# EAGLE design EtherWeeny (EAGLE 6.2)
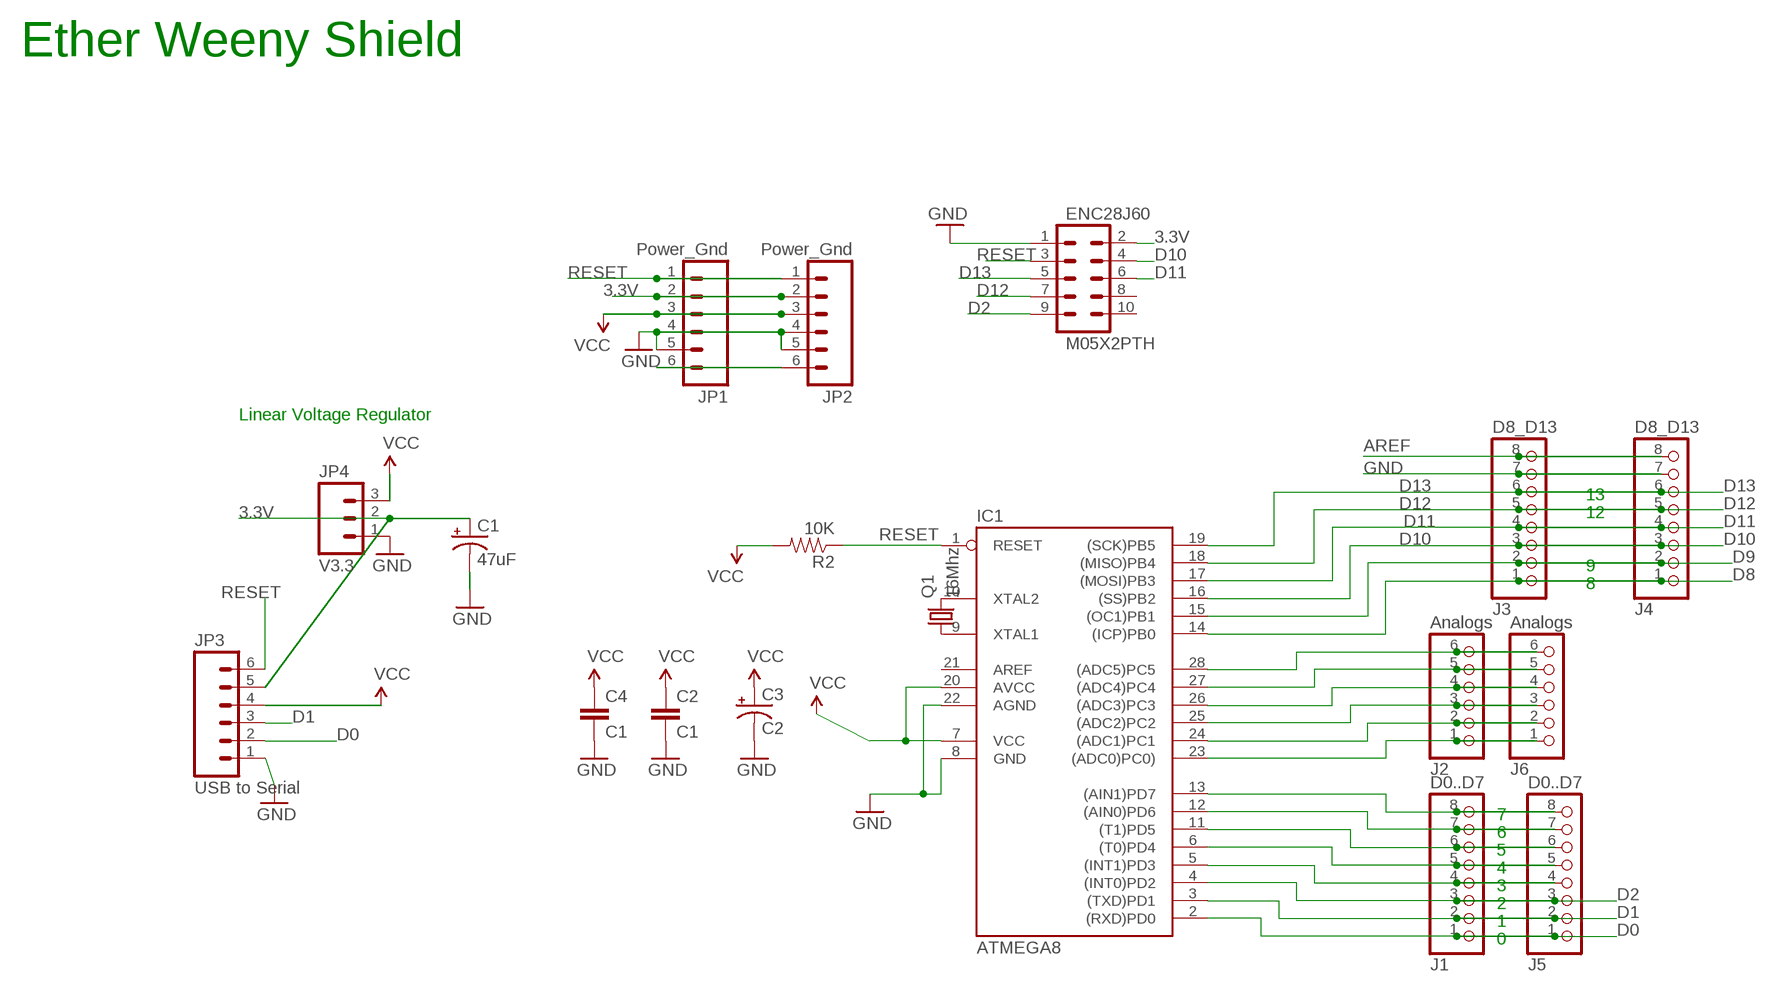
[diagram p0: schematic, sheet 1]

## Parts
C1  47uF  CAP_POLPTH1  [CPOL-RADIAL-100UF-25V]
C2  C1  CAPPTH  [CAP-PTH-SMALL]
C3  C2  CAP_POLPTH1  [CPOL-RADIAL-100UF-25V]
C4  C1  CAPPTH  [CAP-PTH-SMALL]
ENC28J60  M05X2PTH  [AVR_ICSP]
IC1  ATMEGA8  AT90S4433P  [DIL28-3]
J1  D0..D7  PINHD-1X8  [1X08]
J2  Analogs  PINHD-1X6  [1X06]
J3  D8_D13  PINHD-1X8  [1X08]
J4  D8_D13  PINHD-1X8  [1X08]
J5  D0..D7  PINHD-1X8  [1X08]
J6  Analogs  PINHD-1X6  [1X06]
JP1  Power_Gnd  M06SIP  [1X06]
JP2  Power_Gnd  M06SIP  [1X06]
JP3  USB to Serial  M06SIP  [1X06]
JP4  V3.3  M03PTH  [1X03]
Q1  16Mhz  CRYSTALHC49US  [HC49US]
R2  10K  RESISTORPTH1  [AXIAL-0.3]

## Nets
3.3V: C1.1(+) ENC28J60.2 JP1.2 JP2.2 JP3.5 JP4.2
AREF [aref]: J3.8 J4.8
D0: IC1.2((RXD)PD0) J1.1 J5.1 JP3.2
D1: IC1.3((TXD)PD1) J1.2 J5.2 JP3.3
D2: ENC28J60.9 IC1.4((INT0)PD2) J1.3 J5.3
D8: IC1.14((ICP)PB0) J3.1 J4.1
D9: IC1.15((OC1)PB1) J3.2 J4.2
D10: ENC28J60.4 IC1.16((SS)PB2) J3.3 J4.3
D11: ENC28J60.6 IC1.17((MOSI)PB3) J3.4 J4.4
D12: ENC28J60.7 IC1.18((MISO)PB4) J3.5 J4.5
D13: ENC28J60.5 IC1.19((SCK)PB5) J3.6 J4.6
GND [gnd]: C1.2(-) C2.2 C3.2(-) C4.2 ENC28J60.1 IC1.8(GND) IC1.22(AGND) J3.7 J4.7 JP1.4 JP1.5 JP2.4 JP2.5 JP3.1 JP4.1
N$1: IC1.10(XTAL2) Q1.2
N$2: IC1.9(XTAL1) Q1.1
N$3: JP1.6 JP2.6
N$11: IC1.5((INT1)PD3) J1.4 J5.4
N$12: IC1.6((T0)PD4) J1.5 J5.5
N$13: IC1.11((T1)PD5) J1.6 J5.6
N$14: IC1.12((AIN0)PD6) J1.7 J5.7
N$15: IC1.13((AIN1)PD7) J1.8 J5.8
N$16: IC1.23((ADC0)PC0)) J2.1 J6.1
N$17: IC1.24((ADC1)PC1) J2.2 J6.2
N$18: IC1.25((ADC2)PC2) J2.3 J6.3
N$19: IC1.26((ADC3)PC3) J2.4 J6.4
N$20: IC1.27((ADC4)PC4) J2.5 J6.5
N$21: IC1.28((ADC5)PC5) J2.6 J6.6
RESET: ENC28J60.3 IC1.1(RESET) JP1.1 JP2.1 JP3.6 R2.P$1
VCC: C2.1 C3.1(+) C4.1 IC1.7(VCC) IC1.20(AVCC) JP1.3 JP2.3 JP3.4 JP4.3 R2.P$2
Unconnected: ENC28J60.8 ENC28J60.10

## Notes on the sheet
- Ether Weeny Shield
- Linear Voltage Regulator
- 13
- 12
- 9
- 8
- 7
- 6
- 5
- 4
- 3
- 2
- 1
- 0

## Power pins joined to a net without a drawn wire
AREF: IC1.21(AREF)

## Library data of the parts
C1 C3 = SparkFun:CAP_POL: Capacitor Polarized These are standard SMD and PTH capacitors. Normally 10uF, 47uF, and 100uF in electrolytic and tantalum varieties. Always verify the external diameter of the through hole cap, it varies with capacity, voltage, and manufacturer. The EIA devices should be standard.
C2 C4 = SparkFun:CAP: Capacitor Standard 0603 ceramic capacitor, and 0.1" leaded capacitor.
ENC28J60 = SparkFun:M05X2: Header 5x2 Standard 10-pin dual row 0.1" header. Commonly used with AVR-ISP. Use with Spark Fun Electronics SKU: PRT-00778
IC1 = atmel:AT90S4433: MICROCONTROLLER 4 Kbytes FLASH 128 bytes SRAM 256 bytes EEPROM UART 6-channel 10 bit ADC
J1 J3-J5 = pinhead:PINHD-1X8: PIN HEADER
J2 J6 = pinhead:PINHD-1X6: PIN HEADER
JP1-JP3 = SparkFun:M06: Header 6 Standard 6-pin 0.1" header. Use with straight break away headers (SKU : PRT-00116), right angle break away headers (PRT-00553), swiss pins (PRT-00743), machine pins (PRT-00117), and female headers (PRT-00115). Molex polarized connector foot print use with SKU : PRT-08094 with associated crimp pins and housings. NOTES ON THE VARIANTS LOCK and LOCK_LONGPADS... This footprint was designed to help hold the alignment of a through-hole component (i.e. 6-pin header) while soldering it into place. You may notice that each hole has been shifted either up or down by 0.005 of an inch from it's more standard position (which is a perfectly straight line). This slight alteration caused the pins (the squares in the middle) to touch the edges of the holes. Because they are alternating, it causes a "brace" to hold the component in place. 0.005 has proven to be the perfect amount of "off-center" position when using our standard breakaway headers. Although looks a little odd when you look at the bare footprint, once you have a header in there, the alteration is very hard to notice. Also, if you push a header all the way into place, it is covered up entirely on the bottom side. This idea of altering the position of holes to aid alignment will be further integrated into the Sparkfun Library for other footprints. It can help hold any component with 3 or more connection pins.
JP4 = SparkFun:M03: Header 3 Standard 3-pin 0.1" header. Use with straight break away headers (SKU : PRT-00116), right angle break away headers (PRT-00553), swiss pins (PRT-00743), machine pins (PRT-00117), and female headers (PRT-00115). Molex polarized connector foot print use with SKU : PRT-08232 with associated crimp pins and housings.
Q1 = SparkFun:CRYSTAL: Crystals Various standard crystals. Proven footprints. Spark Fun Electronics SKU : COM-00534
R2 = SparkFun:RESISTOR: Resistor Basic schematic elements and footprints for 0603, 1206, and PTH 1/10th watt (small) resistors.

## Net classes
0 default: width 0.254 mm, clearance 0.254 mm
1 power: width 0.61 mm, drill 0.711 mm, clearance 0.33 mm
2 gnd: width 0.305 mm, drill 0.711 mm, clearance 0.254 mm
3 usbvcc: width 0.508 mm, drill 0.711 mm, clearance 0.254 mm
4 aref: width 0.406 mm

## Board
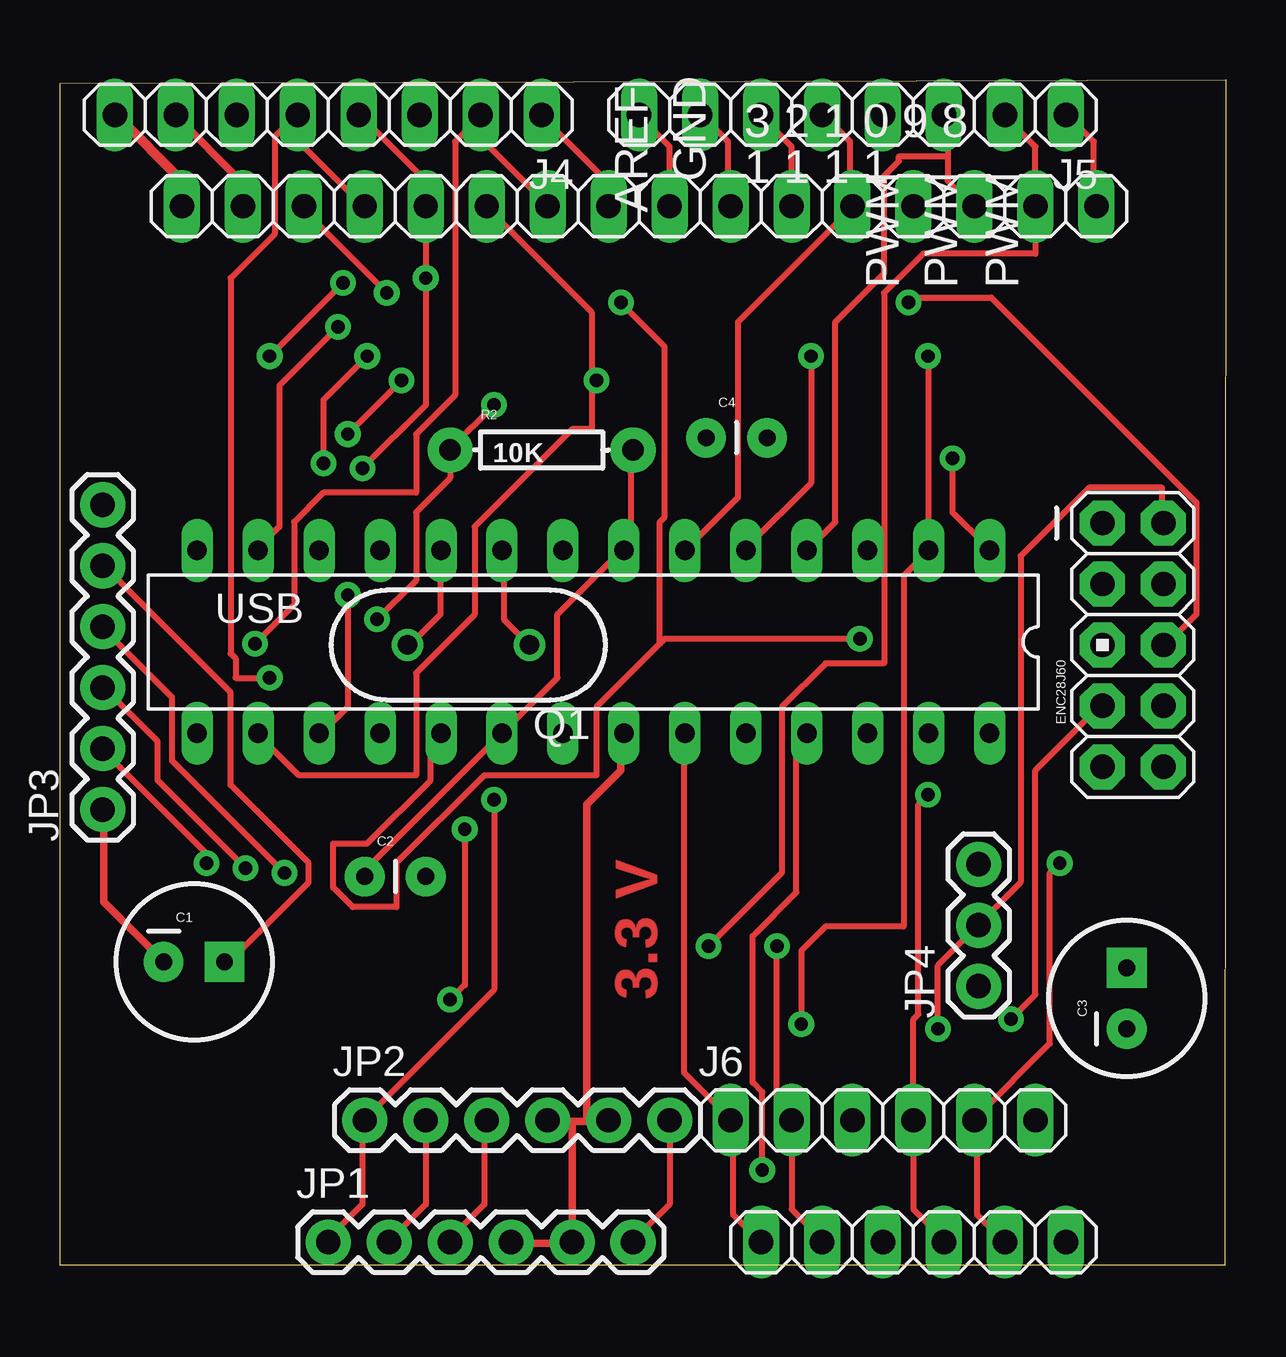
[diagram p1: board, top side]
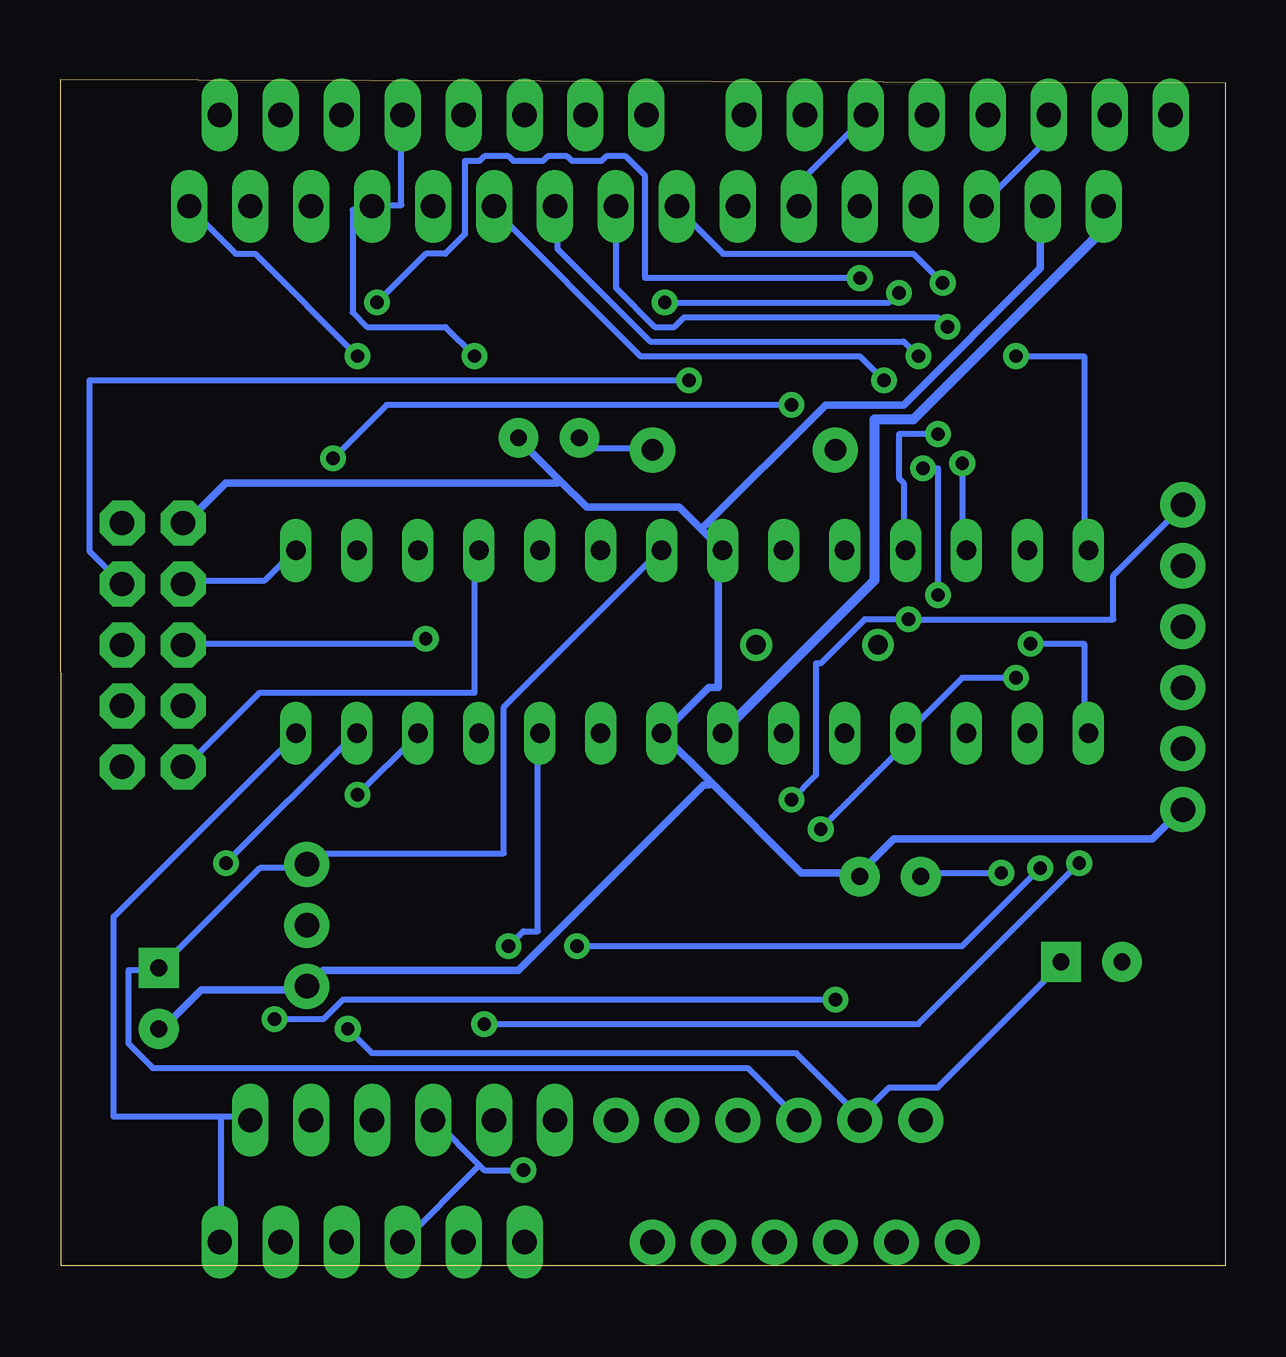
[diagram p2: board, bottom side, seen from below]

Size 48.56 x 49.43 mm. Coordinates in mm from the lower left corner, seen from the top.
Outline: 0,49.28 42.8,49.4 48.56,49.43 48.54,0 0,0 0,49.28
Copper layers (1*16): Top 0.035mm / dielectric 1.5mm / Bottom 0.035mm
Design rules: minimum track width 10mil, minimum drill 22mil, track to track 10mil, track to pad 10mil, pad to pad 10mil, via to via 16mil, smd to smd 8mil, copper to edge 30mil, drill to drill 12mil, minimum pad ring 10mil, minimum via ring 10mil, stop-mask expansion 4mil, vias tented up to drill 0mil, thermal gap 10mil
vRestrict: area 25.4,45.2 to 27.1,48.8; area 33.4,40.7 to 34.9,44.3; area 35.9,40.7 to 37.5,44.3; area 38.5,40.7 to 40,44.3; area 42.5,38.3 to 43.1,38.6

### Footprints (pad centres in the part's own frame; a part is rotated, then mirrored left to right if it is on the bottom)
CPOL-RADIAL-100UF-25V = drill 0.7 pad 1.651 square: 1 1.27,0 | drill 0.7 pad 1.651: 2 -1.27,0
CAP-PTH-SMALL = drill 0.7 pad 1.651: 1 0,0; 2 2.54,0
AVR_ICSP = drill 1.016 pad 1.88 octagon: 1 -1.27,5.08; 2 1.27,5.08; 3 -1.27,2.54; 4 1.27,2.54; 5 -1.27,0; 6 1.27,0; 7 -1.27,-2.54; 8 1.27,-2.54; 9 -1.27,-5.08; 10 1.27,-5.08
DIL28-3 = drill 0.813 long: 1 -16.51,-3.81; 2 -13.97,-3.81; 3 -11.43,-3.81; 4 -8.89,-3.81; 5 -6.35,-3.81; 6 -3.81,-3.81; 7 -1.27,-3.81; 8 1.27,-3.81; 9 3.81,-3.81; 10 6.35,-3.81; 11 8.89,-3.81; 12 11.43,-3.81; 13 13.97,-3.81; 14 16.51,-3.81; 15 16.51,3.81; 16 13.97,3.81; 17 11.43,3.81; 18 8.89,3.81; 19 6.35,3.81; 20 3.81,3.81; 21 1.27,3.81; 22 -1.27,3.81; 23 -3.81,3.81; 24 -6.35,3.81; 25 -8.89,3.81; 26 -11.43,3.81; 27 -13.97,3.81; 28 -16.51,3.81
1X08 = drill 1.016 long: 1 -8.89,0; 2 -6.35,0; 3 -3.81,0; 4 -1.27,0; 5 1.27,0; 6 3.81,0; 7 6.35,0; 8 8.89,0
1X06 = drill 1.016 long: 1 -6.35,0; 2 -3.81,0; 3 -1.27,0; 4 1.27,0; 5 3.81,0; 6 6.35,0
1X06' = drill 1.016 pad 1.88: 1 0,0; 2 2.54,0; 3 5.08,0; 4 7.62,0; 5 10.16,0; 6 12.7,0
1X03 = drill 1.016 pad 1.88: 1 0,0; 2 2.54,0; 3 5.08,0
HC49US = drill 0.813: 1 -2.54,0; 2 2.54,0
AXIAL-0.3 = drill 0.9 pad 1.88: P$1 -3.81,0; P$2 3.81,0

### Placement (x,y rotation side)
C1  5.59,12.65 0 top
C2  12.7,16.21 0 top
C3  44.45,11.13 90 top
C4  26.92,34.49 0 top
ENC28J60  44.7,25.86 0 top
IC1  22.23,25.98 180 top
J1  34.29,44.15 180 top
J2  35.56,0.97 0 top
J3  13.97,44.15 180 top
J4  11.18,47.96 180 top
J5  33.02,47.96 180 top
J6  34.29,6.05 0 top
JP1  Power_Gnd  [1X06']  11.18,0.97 0 top
JP2  Power_Gnd  [1X06']  12.7,6.05 0 top
JP3  USB to Serial  [1X06']  1.78,19 90 top
JP4  38.28,11.63 90 top
Q1  17.02,25.86 180 top
R2  20.07,33.99 0 top

### Tracks (layer width: path | path; a pad name or v marks a point on that pad's centre or on a via)
3.3V  (via drill 0.56)
  Top 0.254: ENC28J60.2 45.92,30.99 45.92,32.41 42.88,32.41 40.03,29.57 40.03,15.95 38.41,14.33 JP4.2 38.2,14.12 36.58,12.5 v36.58,9.86 | JP3.5 1.83,29.16 7.11,23.88 7.11,20.02 10.36,16.76 10.36,15.95 6.91,12.5 C1.1 | JP2.2 15.24,2.54 13.82,1.12 JP1.2
  Bottom 0.254: 15.24,6.2 14.02,7.42 11.99,7.42 6.91,12.5 C1.1 | v36.58,9.86 35.56,8.84 17.88,8.84 15.24,6.2 | 15.24,6.2 JP2.2
AREF
  Top 0.406: J3.8 5.08,45.21 2.44,47.85 J4.8
  Bottom 0.406: J3.8 5.08,43.18 13.01,35.26 14.63,35.26 14.63,28.55 20.93,22.25 IC1.21
D0  (via drill 0.56)
  Top 0.254: v36.17,37.9 36.17,29.97 IC1.2 35.15,28.75 35.15,14.12 31.9,14.12 30.89,13.11 v30.89,10.06 | J5.1 42.06,47.85 43.08,46.84 43.08,44.2 J1.1 | v6.1,16.76 6.1,17.17 1.83,21.44 JP3.2
  Bottom 0.254: v36.17,37.9 40.44,42.16 41.25,42.16 43.08,43.99 J1.1 | v6.1,16.76 12.8,10.06 v30.89,10.06
D1  (via drill 0.56)
  Top 0.254: 34.34,30.58 33.73,29.97 IC1.3 | 34.34,30.58 34.34,40.54 35.97,42.16 40.64,42.16 J1.2 40.64,46.63 39.42,47.85 J5.2 | v7.72,16.56 4.06,20.22 4.06,21.84 1.83,24.08 JP3.3 | v27.03,13.31 30.07,16.36 30.07,23.27 31.9,25.1 34.34,25.1 34.34,30.58
  Bottom 0.254: v7.72,16.56 10.97,13.31 v27.03,13.31
D2
  Top 0.254: 36.98,46.23 36.98,47.85 J5.3 | 36.98,46.23 36.98,45.21 38,44.2 J1.3 | 36.98,46.23 34.95,46.23 34.95,46.03 34.34,45.42 34.34,41.35 32.31,39.32 32.31,30.99 IC1.4
  Bottom 0.254: IC1.4 31.29,29.77 31.29,23.88 40.23,23.88 43.28,20.83 ENC28J60.9
D8  (via drill 0.56)
  Top 0.254: v11.79,40.95 v8.74,37.9 | J4.1 20.12,47.85 22.76,45.21 22.76,44.2 J3.1
  Bottom 0.254: v8.74,37.9 5.89,37.9 5.89,29.97 IC1.14 | v11.79,40.95 13.01,42.16 20.93,42.16 22.76,43.99 J3.1
D9  (via drill 0.56)
  Top 0.254: v8.13,25.91 9.75,27.53 9.75,30.99 10.97,32.21 14.83,32.21 14.83,34.65 16.46,36.27 16.46,46.84 17.07,47.45 | 17.07,47.45 17.48,47.85 J4.2 17.07,47.45 | 17.07,47.45 20.32,44.2 J3.2
  Bottom 0.254: v8.13,25.91 5.89,25.91 5.89,22.25 IC1.15
D10  (via drill 0.56)
  Top 0.254: 22.15,36.88 22.15,39.73 17.88,43.99 J3.3 | 22.15,36.88 22.15,34.85 21.34,34.85 17.27,30.79 17.27,27.13 14.83,24.69 14.83,20.42 9.96,20.42 8.33,22.05 IC1.16 | 22.15,36.88 v22.35,36.88
  Bottom 0.254: J4.3 15.04,47.85 17.68,45.21 17.68,44.2 J3.3 | ENC28J60.4 47.35,29.77 47.35,36.88 v22.35,36.88
D11  (via drill 0.56)
  Top 0.254: v11.99,27.94 11.99,23.27 10.97,22.25 IC1.17 | v12.6,33.22 15.24,35.87 v15.24,41.15 J3.4 15.24,45.21 12.6,47.85 J4.4 | v35.36,40.13 35.36,40.34 38.81,40.34 47.35,31.8 47.35,27.13 46.13,25.91 ENC28J60.6
  Bottom 0.254: v11.99,27.94 11.99,33.22 v12.6,33.22 | v35.36,40.13 33.33,42.16 32.51,42.16 31.7,42.98 31.7,46.03 31.09,46.03 30.89,46.23 29.87,46.23 29.67,46.03 28.45,46.03 28.25,46.23 27.43,46.23 27.23,46.03 26.01,46.03 25.81,46.23 24.99,46.23 24.18,45.42 24.18,41.15 v15.24,41.15
D12  (via drill 0.56)
  Top 0.254: v8.74,24.49 7.32,24.49 7.32,25.3 7.11,25.5 7.11,41.15 8.94,42.98 8.94,47.04 9.35,47.45 | 9.35,47.45 9.75,47.85 J4.5 9.35,47.45 | 9.35,47.45 12.6,44.2 J3.5 | v39.62,10.26 40.64,11.28 40.64,20.63 43.28,23.27 ENC28J60.7 | v16.26,11.07 16.87,11.68 v16.87,18.19
  Bottom 0.254: v8.74,24.49 10.97,24.49 13.21,22.25 IC1.18 13.41,22.05 13.41,21.64 v16.87,18.19 | v39.62,10.26 37.59,10.26 36.78,11.07 v16.26,11.07
D13  (via drill 0.56)
  Top 0.254: 24.99,25.91 25.2,26.11 v33.33,26.11 | 24.99,25.91 22.35,23.27 22.35,20.42 17.68,20.42 14.02,16.76 14.02,14.94 12.19,14.94 11.38,15.75 11.38,17.58 12.8,17.58 15.44,20.22 15.44,21.64 15.85,22.05 IC1.19 | v13.61,40.54 10.16,43.99 J3.6 | v23.37,40.13 25.2,38.3 25.2,31.19 24.99,30.99 24.99,25.91
  Bottom 0.254: J3.6 10.16,44.2 7.52,46.84 7.52,47.85 J4.6 | v33.33,26.11 33.53,25.91 43.28,25.91 ENC28J60.5 | v13.61,40.54 14.02,40.13 v23.37,40.13
GND
  Top 0.305: JP1.4 18.9,0.91 21.34,0.91 JP1.5 21.34,5.99 | 21.95,5.99 22.76,5.99 JP2.5 21.95,5.99 | 21.95,5.99 21.34,5.99 | 21.34,5.99 20.32,5.99 JP2.4 | C1.2 1.83,15.14 1.83,19 JP3.1 | J4.7 4.88,47.85 7.52,45.21 7.52,44.2 J3.7 | 21.95,5.99 21.95,19.2 23.37,20.63 23.37,22.05 IC1.22
  Bottom 0.305: C3.2 44.3,9.86 42.67,11.48 38.41,11.48 JP4.1 38.2,11.68 37.59,12.29 29.46,12.29 21.74,20.02 21.54,20.02 21.44,20.12 | 21.44,20.12 17.68,16.36 15.24,16.36 | 21.44,20.12 IC1.22 23.37,22.25 21.54,24.08 21.13,24.08 21.13,29.77 IC1.8 21.84,30.68 | 27.74,32.72 26.62,31.6 22.76,31.6 21.84,30.68 | 27.74,32.72 29.46,34.44 C4.2 | ENC28J60.1 43.28,30.99 41.66,32.61 27.84,32.61 27.74,32.72 | 21.84,30.68 16.66,35.87 13.41,35.87 7.72,41.55 7.72,43.99 J3.7 | 15.24,16.36 13.82,17.78 3.05,17.78 1.83,19 JP3.1 | 15.24,16.36 C2.2
N$1
  Top 0.254: Q1.2 14.63,25.91 15.85,27.13 15.85,29.77 IC1.10
N$2
  Top 0.254: Q1.1 18.49,26.92 18.49,29.77 IC1.9
N$3
  Top 0.254: JP2.6 25.4,2.54 23.98,1.12 JP1.6
N$11  (via drill 0.56)
  Top 0.254: v31.29,37.9 31.29,32.61 28.65,29.97 IC1.5
  Bottom 0.254: v31.29,37.9 32.51,39.12 35.76,39.12 36.37,39.73 36.37,43.99 35.56,43.99 J1.4 35.56,44.2 34.34,44.2 34.34,47.85 J5.4
N$12
  Top 0.254: IC1.6 28.25,32 28.25,39.32 32.92,43.99 J1.5 32.92,44.2 32.92,46.84 31.9,47.85 J5.5
N$13  (via drill 0.56)
  Top 0.254: v14.22,36.88 v11.99,34.65 | J1.6 30.48,46.63 29.26,47.85 J5.6
  Bottom 0.254: v11.99,34.65 13.61,34.65 13.61,32.82 13.41,32.61 13.41,29.97 IC1.11 | v14.22,36.88 15.24,37.9 24.38,37.9 30.48,43.99 J1.6
N$14  (via drill 0.56)
  Top 0.254: v10.97,33.43 10.97,36.07 v12.8,37.9 | J5.7 26.82,47.85 27.84,46.84 27.84,44.2 J1.7
  Bottom 0.254: v10.97,33.43 10.97,29.97 IC1.12 | v12.8,37.9 13.41,38.51 23.98,38.51 27.84,42.37 27.84,43.99 J1.7
N$15  (via drill 0.56)
  Top 0.254: v11.58,39.12 9.14,36.68 9.14,30.79 8.33,29.97 IC1.13 | J1.8 25.4,46.63 24.18,47.85 J5.8
  Bottom 0.254: v11.58,39.12 11.99,39.52 22.55,39.52 22.96,39.12 23.77,39.12 25.4,40.74 J1.8
N$16
  Top 0.254: IC1.23 26.01,22.05 26.01,8.03 27.84,6.2 J6.1 28.04,5.99 28.04,2.13 J2.1
N$17  (via drill 0.56)
  Top 0.254: v29.87,13.31 29.87,6.81 30.48,6.2 J6.2 30.48,2.34 31.7,1.12 J2.2
  Bottom 0.254: v29.87,13.31 29.26,13.92 28.65,13.92 28.65,22.05 IC1.24
N$18  (via drill 0.56)
  Top 0.254: v29.26,3.96 29.26,7.21 28.85,7.62 28.85,13.72 30.68,15.55 30.68,21.64 31.09,22.05 IC1.25
  Bottom 0.254: v29.26,3.96 30.89,3.96 31.09,4.17 | 31.09,4.17 32.92,5.99 J6.3 | 31.09,4.17 J2.3
N$19  (via drill 0.56)
  Top 0.254: v36.17,19.61 35.76,19.2 35.76,10.47 35.56,10.26 J6.4 35.56,2.34 36.78,1.12 J2.4
  Bottom 0.254: v36.17,19.61 33.73,22.05 IC1.26
N$20  (via drill 0.56)
  Top 0.254: v41.66,16.76 41.25,16.36 41.25,9.25 38.2,6.2 J6.5 38.2,5.99 38.2,2.13 J2.5
  Bottom 0.254: v41.66,16.76 36.37,22.05 IC1.27
N$21
  Bottom 0.254: 41.86,6.2 40.64,6.2 J6.6 | 41.86,6.2 46.33,6.2 46.33,14.53 38.81,22.05 IC1.28 | 41.86,6.2 41.86,1.12 J2.6
RESET  (via drill 0.56)
  Top 0.254: JP1.1 11.18,1.12 12.6,2.54 12.6,5.99 JP2.1 12.8,6.2 18.09,11.48 v18.09,19.41 | v13.21,26.92 14.83,28.55 14.83,31.39 16.26,32.82 R2.P$1 16.26,34.04 v18.09,35.87 | v37.19,33.63 37.19,31.39 38.61,29.97 IC1.1
  Bottom 0.254: IC1.1 38.81,29.77 40.03,28.55 43.28,28.55 ENC28J60.3 | JP3.6 1.83,31.6 4.67,28.75 4.67,26.92 v13.21,26.92 15.04,26.92 16.87,25.1 17.07,25.1 17.07,20.42 v18.09,19.41 | v37.19,33.63 34.95,35.87 v18.09,35.87
VCC  (via drill 0.56)
  Top 0.254: R2.P$2 23.77,33.83 23.77,30.18 23.57,29.97 IC1.7 23.37,29.77 20.73,27.13 20.73,24.49 IC1.20 12.8,16.56 12.8,16.36 C2.1 | v9.35,16.36 4.67,21.03 4.67,23.67 1.83,26.52 JP3.4 | JP1.3 16.26,1.12 17.68,2.54 17.68,5.99 JP2.3
  Bottom 0.254: C4.1 26.82,34.44 26.42,34.04 23.98,34.04 R2.P$2 | v9.35,16.36 12.6,16.36 C2.1 | JP2.3 17.88,6.2 19.91,8.23 44.7,8.23 45.72,9.25 45.72,12.29 44.5,12.29 C3.1 44.3,12.5 40.23,16.56 38.41,16.56 JP4.3 38.2,16.76 37.8,17.17 30.07,17.17 30.07,23.27 23.57,29.77 IC1.7

### Text on the board
Top: 3.3 V
tNames: 3 2 1 0 9 8 | GND | 1 1 1 1 | AREF | PWM | PWM | PWM | USB
Reference: C8 | C2 | R11 | C4 | C5